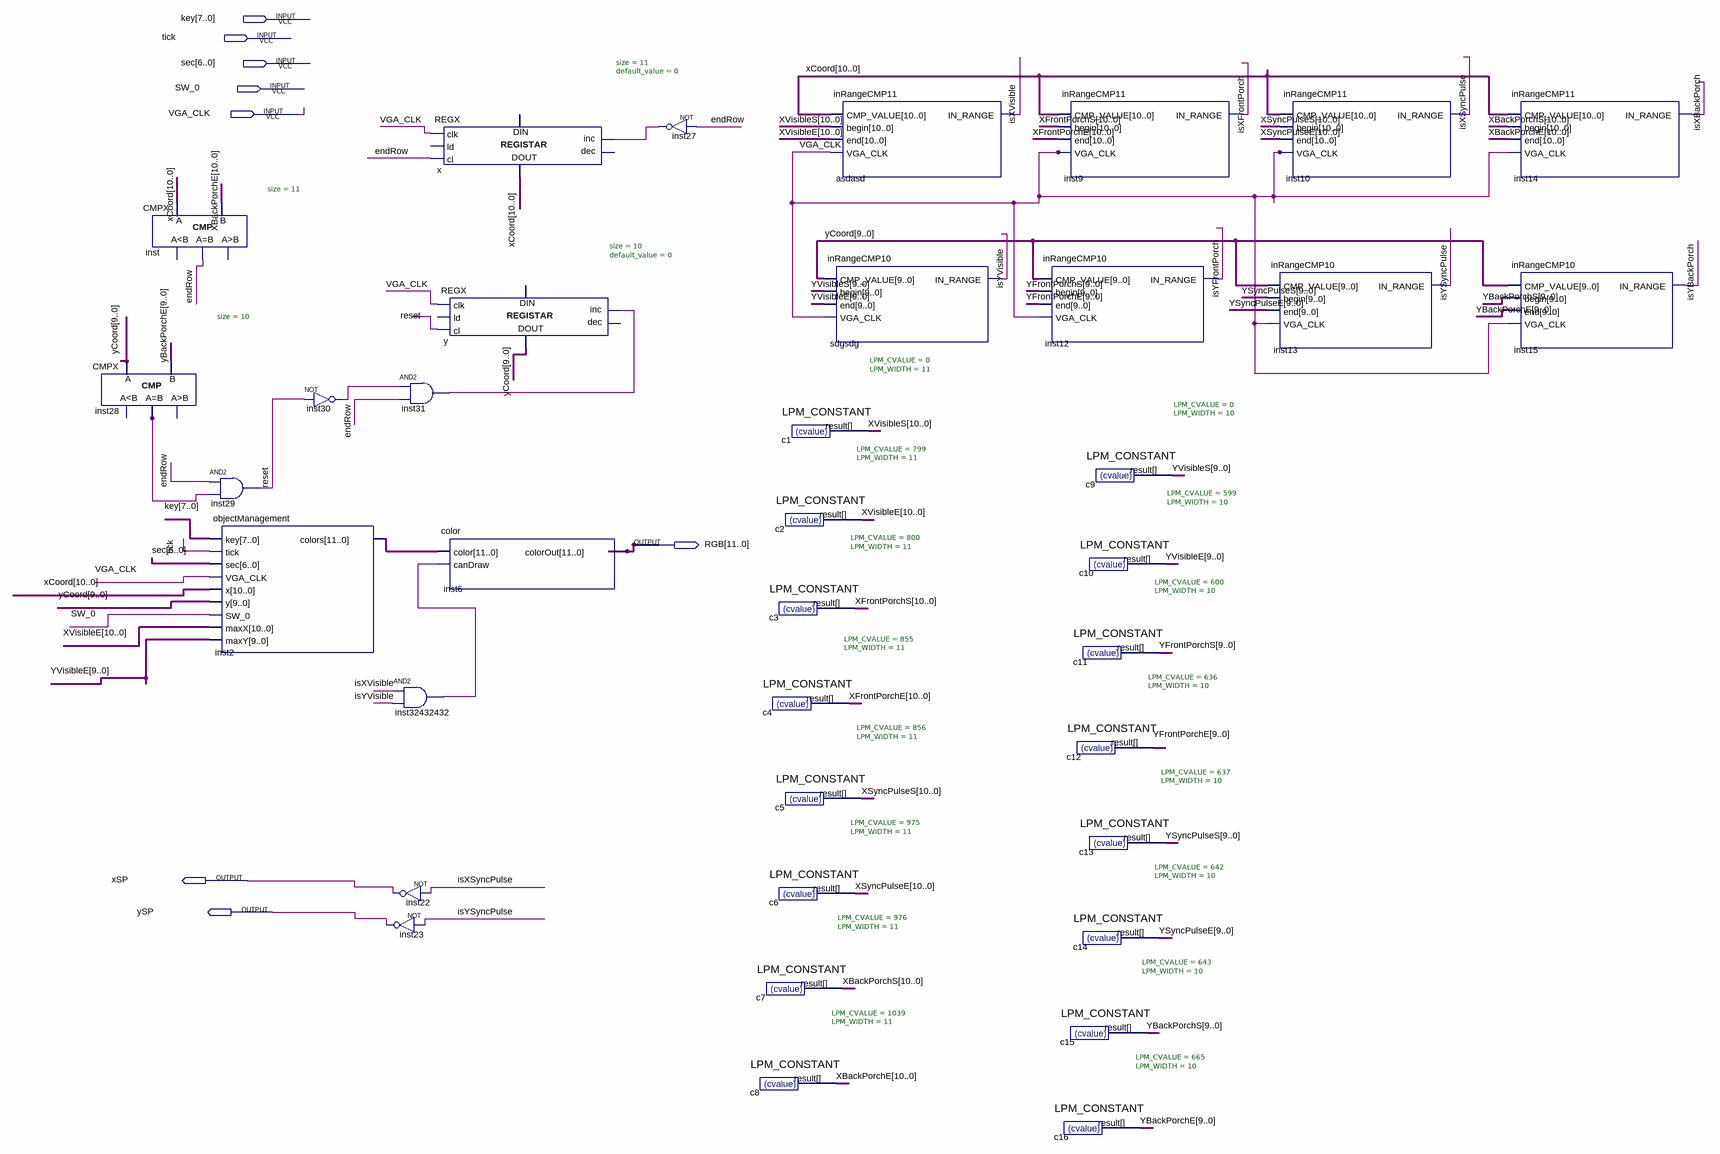
[diagram p0: schematic sheet]
// Quartus schematic VGA.bdf as structural Verilog: 37 symbols, 8 pins
module VGA (
  input  [7:0] key,
  input  tick,
  input  [6:0] sec,
  input  SW_0,
  input  VGA_CLK,
  output [11:0] RGB,
  output xSP,
  output ySP
);

  wire endRow, inst27_out, inst28_eq, inst30_out, inst31_out, inst32432432_out, isXBackPorch, isXFrontPorch,
       isXSyncPulse, isXVisible, isYBackPorch, isYFrontPorch, isYSyncPulse, isYVisible, reset;
  wire [9:0] YBackPorchE, YBackPorchS, yCoord, YFrontPorchE, YFrontPorchS, YSyncPulseE, YSyncPulseS,
       YVisibleE, YVisibleS;
  wire [10:0] XBackPorchE, XBackPorchS, xCoord, XFrontPorchE, XFrontPorchS, XSyncPulseE, XSyncPulseS,
       XVisibleE, XVisibleS;
  wire [11:0] inst2_colors;

  CMPX #(.size(10)) inst28 (.A(yCoord), .B(YBackPorchE), .eq(inst28_eq));  // open: ls, gr
  CMPX #(.size(11)) inst (.A(xCoord), .B(XBackPorchE), .eq(endRow));  // open: ls, gr
  and inst29 (reset, endRow, inst28_eq);
  objectManagement inst2 (
    .key(key), .tick(tick), .sec(sec), .VGA_CLK(VGA_CLK), .x(xCoord), .y(yCoord), .SW_0(SW_0),
    .maxX(XVisibleE), .maxY(YVisibleE), .colors(inst2_colors));
  not inst30 (inst30_out, reset);
  and inst31 (inst31_out, inst30_out, endRow);
  and inst32432432 (inst32432432_out, isXVisible, isYVisible);
  not inst22 (xSP, isXSyncPulse);
  not inst23 (ySP, isYSyncPulse);
  REGX #(.size(11), .default_value(0)) x (
    .clk(VGA_CLK), .cl(endRow), .inc(inst27_out), .data_out(xCoord));  // open: ld, dec, data_in
  REGX #(.size(10), .default_value(0)) y (
    .clk(VGA_CLK), .cl(reset), .inc(inst31_out), .data_out(yCoord));  // open: ld, dec, data_in
  color inst6 (.color(inst2_colors), .canDraw(inst32432432_out), .colorOut(RGB));
  not inst27 (inst27_out, endRow);
  LPM_CONSTANT #(.LPM_CVALUE(976), .LPM_WIDTH(11)) c7 (.result(XBackPorchS));
  LPM_CONSTANT #(.LPM_CVALUE(1039), .LPM_WIDTH(11)) c8 (.result(XBackPorchE));
  LPM_CONSTANT #(.LPM_CVALUE(0), .LPM_WIDTH(11)) c1 (.result(XVisibleS));
  LPM_CONSTANT #(.LPM_CVALUE(799), .LPM_WIDTH(11)) c2 (.result(XVisibleE));
  LPM_CONSTANT #(.LPM_CVALUE(800), .LPM_WIDTH(11)) c3 (.result(XFrontPorchS));
  LPM_CONSTANT #(.LPM_CVALUE(855), .LPM_WIDTH(11)) c4 (.result(XFrontPorchE));
  LPM_CONSTANT #(.LPM_CVALUE(856), .LPM_WIDTH(11)) c5 (.result(XSyncPulseS));
  LPM_CONSTANT #(.LPM_CVALUE(975), .LPM_WIDTH(11)) c6 (.result(XSyncPulseE));
  inRangeCMP11 asdasd (
    .CMP_VALUE(xCoord), .\begin (XVisibleS), .\end (XVisibleE), .VGA_CLK(VGA_CLK), .IN_RANGE(isXVisible));
  inRangeCMP10 sdgsdg (
    .CMP_VALUE(yCoord), .\begin (YVisibleS), .\end (YVisibleE), .VGA_CLK(VGA_CLK), .IN_RANGE(isYVisible));
  inRangeCMP11 inst9 (
    .CMP_VALUE(xCoord), .\begin (XFrontPorchS), .\end (XFrontPorchE), .VGA_CLK(VGA_CLK),
    .IN_RANGE(isXFrontPorch));
  inRangeCMP10 inst12 (
    .CMP_VALUE(yCoord), .\begin (YFrontPorchS), .\end (YFrontPorchE), .VGA_CLK(VGA_CLK),
    .IN_RANGE(isYFrontPorch));
  LPM_CONSTANT #(.LPM_CVALUE(643), .LPM_WIDTH(10)) c15 (.result(YBackPorchS));
  LPM_CONSTANT #(.LPM_CVALUE(665), .LPM_WIDTH(10)) c16 (.result(YBackPorchE));
  LPM_CONSTANT #(.LPM_CVALUE(0), .LPM_WIDTH(10)) c9 (.result(YVisibleS));
  LPM_CONSTANT #(.LPM_CVALUE(599), .LPM_WIDTH(10)) c10 (.result(YVisibleE));
  LPM_CONSTANT #(.LPM_CVALUE(600), .LPM_WIDTH(10)) c11 (.result(YFrontPorchS));
  LPM_CONSTANT #(.LPM_CVALUE(636), .LPM_WIDTH(10)) c12 (.result(YFrontPorchE));
  LPM_CONSTANT #(.LPM_CVALUE(637), .LPM_WIDTH(10)) c13 (.result(YSyncPulseS));
  LPM_CONSTANT #(.LPM_CVALUE(642), .LPM_WIDTH(10)) c14 (.result(YSyncPulseE));
  inRangeCMP11 inst10 (
    .CMP_VALUE(xCoord), .\begin (XSyncPulseS), .\end (XSyncPulseE), .VGA_CLK(VGA_CLK), .IN_RANGE(isXSyncPulse));
  inRangeCMP10 inst13 (
    .CMP_VALUE(yCoord), .\begin (YSyncPulseS), .\end (YSyncPulseE), .VGA_CLK(VGA_CLK), .IN_RANGE(isYSyncPulse));
  inRangeCMP11 inst14 (
    .CMP_VALUE(xCoord), .\begin (XBackPorchS), .\end (XBackPorchE), .VGA_CLK(VGA_CLK), .IN_RANGE(isXBackPorch));
  inRangeCMP10 inst15 (
    .CMP_VALUE(yCoord), .\begin (YBackPorchS), .\end (YBackPorchE), .VGA_CLK(VGA_CLK), .IN_RANGE(isYBackPorch));
endmodule
